# Altium schematic sheet TSAL.SchDoc
size A4; SheetNumber: 4; SheetTotal: 5
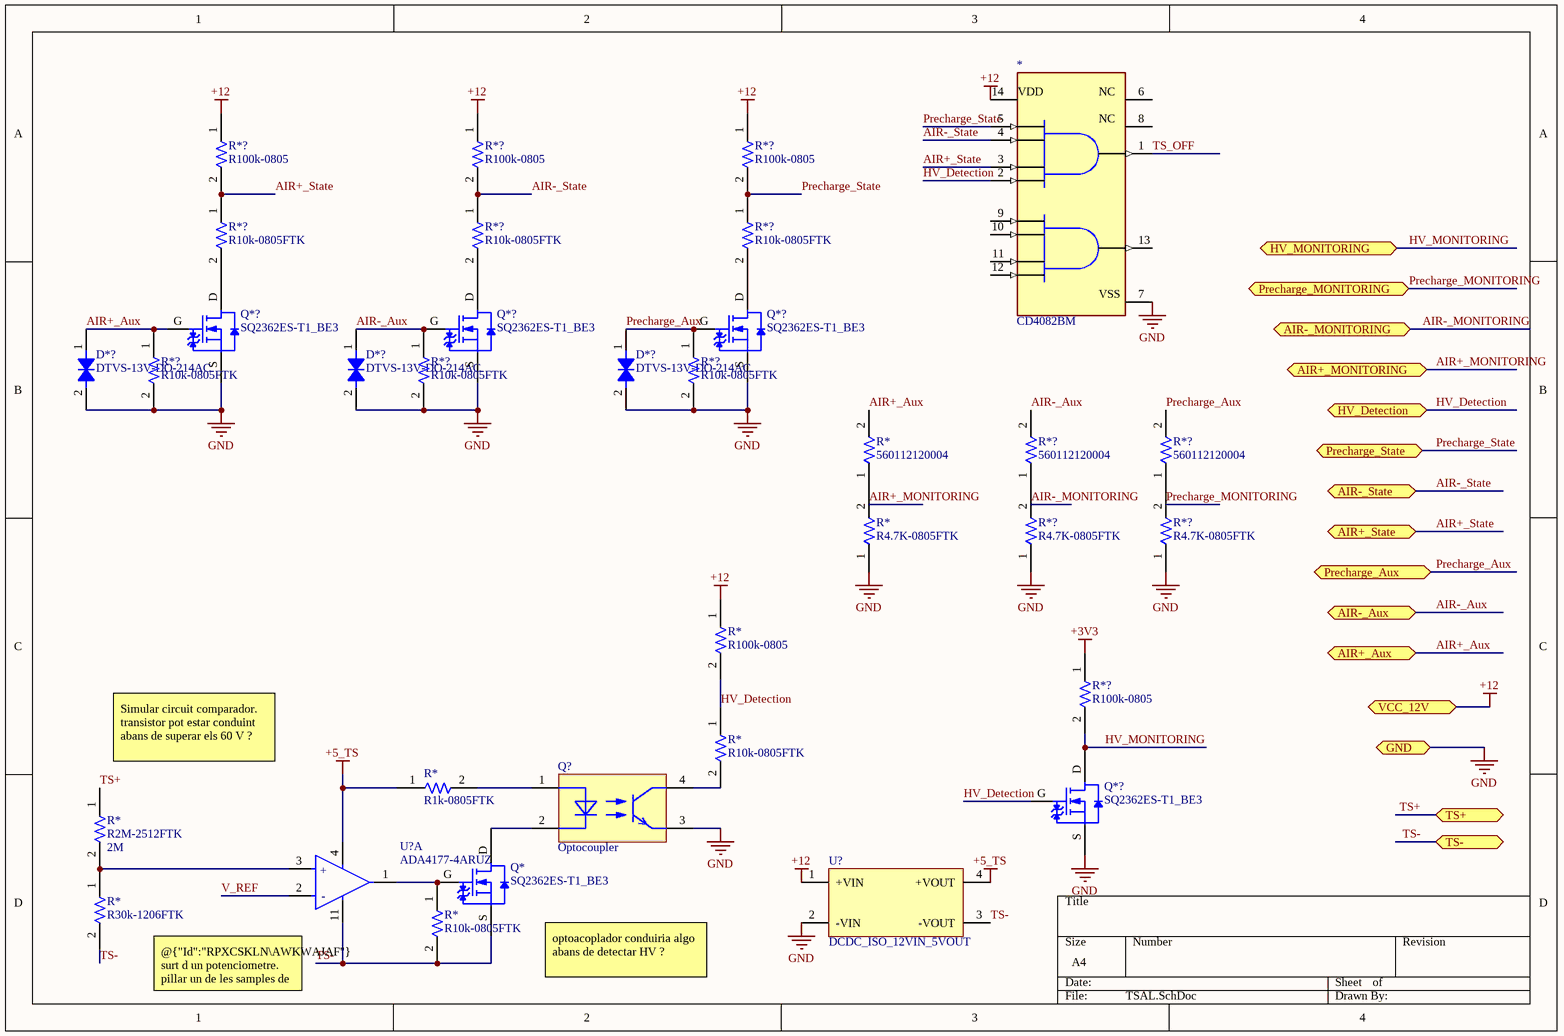
[diagram p0: TSAL.SchDoc]

## Parts
(Parts that share a designator on the sheet are numbered #1, #2 ... from top to bottom, then left to right.)
*  CD4082BM  [D0014A_M]
D*?#1  DTVS-13V-DO-214AC  [DTVS-DO-214AC]
D*?#2  DTVS-13V-DO-214AC  [DTVS-DO-214AC]
D*?#3  DTVS-13V-DO-214AC  [DTVS-DO-214AC]
Q*  SQ2362ES-T1_BE3  [SOT95P245X110-3N]
Q*?#1  SQ2362ES-T1_BE3  [SOT95P245X110-3N]
Q*?#2  SQ2362ES-T1_BE3  [SOT95P245X110-3N]
Q*?#3  SQ2362ES-T1_BE3  [SOT95P245X110-3N]
Q*?#4  SQ2362ES-T1_BE3  [SOT95P245X110-3N]
Q?  Optocoupler  [WL-OCPT_LSOP4]
R*#1  560112120004  [FP-CRCW0805-HPe3-IPC_B]
R*#2  R4.7K-0805FTK  [R0805FTK]
R*#3  R100k-0805  [RESC2013X70X40NL20T20]
R*#4  R10k-0805FTK  [R0805FTK]
R*#5  R2M-2512FTK  Resistance: 2M  [R2512FTK]
R*#6  R1k-0805FTK  [R0805FTK]
R*#7  R30k-1206FTK  [R1206FTK-W]
R*#8  R10k-0805FTK  [R0805FTK]
R*?#1  R100k-0805  [RESC2013X70X40NL20T20]
R*?#2  R100k-0805  [RESC2013X70X40NL20T20]
R*?#3  R100k-0805  [RESC2013X70X40NL20T20]
R*?#4  R10k-0805FTK  [R0805FTK]
R*?#5  R10k-0805FTK  [R0805FTK]
R*?#6  R10k-0805FTK  [R0805FTK]
R*?#7  R10k-0805FTK  [R0805FTK]
R*?#8  R10k-0805FTK  [R0805FTK]
R*?#9  R10k-0805FTK  [R0805FTK]
R*?#10  560112120004  [FP-CRCW0805-HPe3-IPC_B]
R*?#11  560112120004  [FP-CRCW0805-HPe3-IPC_B]
R*?#12  R4.7K-0805FTK  [R0805FTK]
R*?#13  R4.7K-0805FTK  [R0805FTK]
R*?#14  R100k-0805  [RESC2013X70X40NL20T20]
U?#1  ADA4177-4ARUZ  [FP-RU-14-IPC_A]  (part A of 4)
U?#2  DCDC_ISO_12VIN_5VOUT  [WPME-FISM_SIP-7_L19.65W7.05H10.16]

## Ports
AIR+_Aux (bidir, see Master_HV_PCB[1B]), AIR+_MONITORING (bidir, see Master_HV_PCB[1B]), AIR+_State (bidir, see Master_HV_PCB[1B]), AIR-_Aux (bidir, see Master_HV_PCB[1B]), AIR-_MONITORING (bidir, see Master_HV_PCB[1B]), AIR-_State (bidir, see Master_HV_PCB[1C]), GND (bidir, see Master_HV_PCB[1B]), HV_Detection (bidir, see Master_HV_PCB[1B]), HV_MONITORING (bidir, see Master_HV_PCB[1B]), Precharge_Aux (bidir, see Master_HV_PCB[1B]), Precharge_MONITORING (bidir, see Master_HV_PCB[1B]), Precharge_State (bidir, see Master_HV_PCB[1C]), TS+ (bidir, see Master_HV_PCB[1B]), TS- (bidir, see Master_HV_PCB[1B]), VCC_12V (bidir, see Master_HV_PCB[1C])

## Nets
+3V3: R*?#14.1
+5_TS: R*#6.1 U?#1.4(V+) U?#2.4(+VOUT)
+12: *.14(A) R*#3.1 R*?#1.1 R*?#2.1 R*?#3.1 U?#2.1(+VIN) ; port VCC_12V
GND: *.7(A) D*?#1.2 D*?#2.2 D*?#3.2 Q*?#1.S Q*?#2.S Q*?#3.S Q*?#4.S Q?.3(Emitter) R*#2.1 R*?#7.2 R*?#8.2 R*?#9.2 R*?#12.1 R*?#13.1 U?#2.2(-VIN) ; port GND
AIR+_Aux: D*?#1.1 Q*?#1.G R*#1.2 R*?#7.1 ; port AIR+_Aux
AIR+_MONITORING: port AIR+_MONITORING
AIR+_State: *.3(C) R*?#1.2 R*?#4.1 ; port AIR+_State
AIR-_Aux: D*?#2.1 Q*?#2.G R*?#8.1 R*?#10.2 ; port AIR-_Aux
AIR-_MONITORING: port AIR-_MONITORING
AIR-_State: *.4(B) R*?#2.2 R*?#5.1 ; port AIR-_State
HV_Detection: *.2(D) Q*?#4.G R*#3.2 R*#4.1 ; port HV_Detection
HV_MONITORING: Q*?#4.D R*?#14.2 ; port HV_MONITORING
Precharge_Aux: D*?#3.1 Q*?#3.G R*?#9.1 R*?#11.2 ; port Precharge_Aux
Precharge_MONITORING: port Precharge_MONITORING
Precharge_State: *.5(A) R*?#3.2 R*?#6.1 ; port Precharge_State
TS+: R*#5.1 ; port TS+
TS-: Q*.S R*#7.2 R*#8.2 U?#1.11(V-) U?#2.3(-VOUT) ; port TS-
TS_OFF: *.1(J)
V_REF: U?#1.2(-IN_A)
NetQ*?#1_D: Q*?#1.D R*?#4.2
NetQ*?#2_D: Q*?#2.D R*?#5.2
NetQ*?#3_D: Q*?#3.D R*?#6.2
NetQ*_D: Q*.D Q?.2(Cathode)
NetQ*_G: Q*.G R*#8.1 U?#1.1(OUT_A)
NetQ?_1: Q?.1(Anode) R*#6.2
NetQ?_4: Q?.4(Collector) R*#4.2
NetR*#1_1: R*#1.1 R*#2.2
NetR*#5_2: R*#5.2 R*#7.1 U?#1.3(+IN_A)
NetR*?#10_1: R*?#10.1 R*?#12.2
NetR*?#11_1: R*?#11.1 R*?#13.2

Not connected (* = marked no-connect by the designer): * 6(J) 8(J) 9(A) 10(B) 11(C) 12(D) 13(J)

## Notes on the sheet
- Simular circuit comparador. transistor pot estar conduint abans de superar els 60 V ?
- @{"Id":"RPXCSKLN\AWKWAJAF"} surt d un potenciometre. pillar un de les samples de vishay
- optoacoplador conduiria algo abans de detectar HV ?
- (in symbol CMP-014-00003-2, part A) +; -
- (in symbol CMP-00204-2) VDD; NC; VSS

## Library data of the parts
* = CMP-00204-2: AND Gate, 4000/14000/40000 Series, 2-Func, 4-Input, CMOS, PDSO14; Package Equivalence Code: SOP14,.25; Channels: 2; Prop. Delay@Nom-Sup: 250ns; Package Body Material: Plastic; Max Supply Voltage: 18V; Nominal Supply Voltage: 5V; Power Supplies: 5/15V; Qualification Status: Not Qualified; Load Capacitance (CL): 50pF; Number of Inputs: 4; Min Supply Voltage: 3V; Load/Preset Input: Yes; Schmitt Trigger: No; Terminal Finish: Nickel; Terminal Pitch: 1.27mm; ComponentLink7Description: https://datasheet.ciiva.com/6621/cd4011ub-6621175.pdf?src-supplier=Digi-Key; JESD-30 Code: R-PDSO-G14; Reach SVHC Compliant: Yes; Surface Mount: Yes; Temperature Grade: MILITARY; ComponentLink4Description: https://datasheet.ciiva.com/15093/getdatasheetpartid-293403-15093688.pdf?src-supplier=Verical; ComponentLink6Description: https://datasheet.ciiva.com/6621/cd4011ub-6621174.pdf?src-supplier=Digi-Key; ComponentLink3Description: https://datasheet.ciiva.com/1506/1862404-1506704.pdf?src-supplier=Element14; ComponentLink5Description: https://datasheet.ciiva.com/41455/001015562-da-01-en-ic-dual-bin-up-coun-cd4520bm-soic-16-tid-41455477.pdf?src-supplier=Conrad; ComponentLink9Description: https://datasheet.ciiva.com/6623/cd4520b-6623849.pdf?src-supplier=Digi-Key; ComponentLink10Description: Where buy it; JESD-609 Code: e4; Technology: CMOS; Moisture Sensitivity Level: 1; Pins: 14; Packaging: Rail/Tube; ComponentLink8Description: https://datasheet.ciiva.com/6621/cd4011ub-6621176.pdf?src-supplier=Digi-Key; Length: 8.65mm; Width: 3.9mm; Package Shape: Rectangular; Case/Package: SOP; Terminal Position: DUAL; Min Operating Temperature: -55°C; Peak Reflow Temperature (Cel): 260°C; Logic Type: AND GATE; ComponentLink1Description: https://datasheet.ciiva.com/14295/cd4520b-mil-14295930.pdf?src-supplier=Avnet; Max Operating Temperature: 125°C; Propagation Delay (tpd): 250ns; ComponentLink2Description: https://datasheet.ciiva.com/14307/cd4011ub-mil-14307943.pdf?src-supplier=Avnet; RoHS Compliant: Yes; Height - Seated (Max): 1.75mm; Terminal Form: Gull Wing; Package Style: SMALL OUTLINEMeter
D*?#1-D*?#3 = CMP-00155-1: Tvs Diode, 400W, 13V, Bidir, DO-214AC; Manufacturer Part Number: 824501131; Manufacturer: Wurth Electronics; Peak Pulse Current: 18.6A; Power Line Protection: No; .Creator: DO; Forward Voltage: 15.15V; Polarity: Bidirectional; Number of Bidirectional Channels: 1; Clamping Voltage: 21.5V; Max Operating Temperature: 150°C; Category: TVS Diodes; Stock 1: 1000; RoHS: Yes; ComponentLink3Description: Where buy it; Source: Filter components.SchLib; Design Item ID: DTVS-13V-DO-214AC; REACH SVHC: Unknown; Min Operating Temperature: -65°C; Resistor Type: Zener; ComponentLink2Description: http://www.farnell.com/datasheets/2036399.pdf?src-supplier=Element14; Peak Pulse Power: 400W; ComponentLink1URL: https://katalog.we-online.de/pbs/datasheet/824501131.pdf?src-supplier=Digi-Key; Packaging: Cut Tape; ComponentLink2URL: http://www.farnell.com/datasheets/2036399.pdf?src-supplier=Element14; ComponentLink3URL: https://www.we-online.com/catalog/en/WE-TVSP?sq=824501131#824501131; RoHS Compliant: Yes; Reverse Standoff Voltage: 13V; Mount: Surface Mount; Min Breakdown Voltage: 15.15V; ComponentLink1Description: https://katalog.we-online.de/pbs/datasheet/824501131.pdf?src-supplier=Digi-Key; Pricing 1: 1=0,27000 (USD); Pins: 2
Q* Q*?#1-Q*?#4 = CMP-013-00001-1: Small Signal Field-Effect Transistor; RoHS Compliant: Yes
Q? = CMP-00195-1: Transistor Output Optocoupler. S/N: 140100146000; RoHS Compliant: Yes
R*#1 R*?#10 R*?#11 = CMP-009-00021-1: Resistor, 10K, 0.25W, Thick Film, 0805 Rohs Compliant: Yes
R*#2 R*?#12 R*?#13 = CMP-00102-1: Res Thick Film 0805 4.7K Ohm 5% 1/8W ±200ppm/°C Molded SMD SMD Paper Tape on Plastic Reel; Manufacturer Part Number 1: CR0805-JW-472ELF; Manufacturer 1: Bourns; Max Power Dissipation: 125mW; .Creator: DR; Voltage Rating (DC): 150V; ComponentLink5URL: https://datasheet.ciiva.com/9122/chpreztr-9122814.pdf?src-supplier=Avnet; ComponentLink2URL: https://datasheet.ciiva.com/6560/chpreztr-6560073.pdf?src-supplier=Digi-Key; Depth: 1.25mm; ComponentLink7URL: https://datasheet.ciiva.com/6560/chpreztr-6560075.pdf?src-supplier=Digi-Key; Radiation Hardening: No; ComponentLink5Description: https://datasheet.ciiva.com/9122/chpreztr-9122814.pdf?src-supplier=Avnet; Construction: Rectangular; Case/Package: 0805; Design Item ID: R4.7K-0805FTK; RoHS Compliant: Yes; Min Operating Temperature: -55°C; Height: 0.024inch; ComponentLink1Description: https://datasheet.ciiva.com/5541/chpreztr-5541593.pdf?src-supplier=Mouser; Series: CR0805; Packaging: Tape and Reel; Width: 0.049inch; Stock 1: 3734; ComponentLink3URL: https://datasheet.ciiva.com/6560/chpreztr-6560074.pdf?src-supplier=Digi-Key; ComponentLink4URL: https://datasheet.ciiva.com/30174/159chpreztr-30174252.pdf?src-supplier=Onlinecomponents.com; Value: 4.7k; Military Standard: Not; Tolerance: 5%; Voltage Rating: 150V; ComponentLink6Description: https://datasheet.ciiva.com/22713/691949-22713272.pdf?src-supplier=Element14; REACH SVHC: No SVHC; Package Quantity: 1; Termination: SMD/SMT; ComponentLink1URL: https://datasheet.ciiva.com/5541/chpreztr-5541593.pdf?src-supplier=Mouser; ComponentLink4Description: https://datasheet.ciiva.com/30174/159chpreztr-30174252.pdf?src-supplier=Onlinecomponents.com; Resistor Type: Thick Film; Length: 2mm; Case Code (Metric): 2012; Category: Chip SMD Resistors; Resistance Tolerance: 5%; Thickness: 508um; ComponentLink6URL: https://datasheet.ciiva.com/22713/691949-22713272.pdf?src-supplier=Element14; Features: Moisture Resistant; Power Rating: 125mW; RoHS: Yes; Mount: Surface Mount; ComponentLink7Description: https://datasheet.ciiva.com/6560/chpreztr-6560075.pdf?src-supplier=Digi-Key; Number of Terminations: 2; Source: Passives.SchLib; Temperature Coefficient: 200ppm/°C; Max Operating Temperature: 155°C; ComponentLink3Description: https://datasheet.ciiva.com/6560/chpreztr-6560074.pdf?src-supplier=Digi-Key; ComponentLink2Description: https://datasheet.ciiva.com/6560/chpreztr-6560073.pdf?src-supplier=Digi-Key; Pricing 1: 1=0,05590, 10=0,01670, 25=0,01290, 100=0,00840, 250=0,00830, 500=0,00690, 1000=0,00410 (USD); Contact Plating: Tin
R*#3 R*?#1-R*?#3 R*?#14 = CMP-009-00003-2: Fixed Resistor, Metal Glaze/thick Film, 0.125W, 100000ohm, 150V, 5% +/-Tol, 200ppm/Cel, Surface Mount, 0805; Value: 100k; Power: 125mW; Max Operating Temperature: 155°C; Mounting Technology: Surface Mount; RoHS Compliant: Yes; Min Operating Temperature: -55°C; Pins: 2; Case/Package: 0805; Tolerance: 5%
R*#4 R*#8 R*?#4-R*?#9 = CMP-00085-1: BOURNS         CR0805-JW-103ELF            Surface Mount Chip Resistor, Thick Film, CR Series, 10 kohm, 125 mW,  5%, 150 V; .Creator: DR; Power Rating: 125mW; Voltage Rating (DC): 100V; Voltage Rating: 150V; Temperature Coefficient: 200ppm/°C; Value: 10k; ComponentLink6URL: https://datasheet.ciiva.com/16783/70154685-16783482.pdf?src-supplier=Allied+Electronics; Manufacturer 1: Bourns; Package Quantity: 1; ComponentLink10URL: https://datasheet.ciiva.com/7985/1856384-7985869.pdf?src-supplier=Element14; Technology: THICK FILM; Source: Passives.SchLib; RoHS Compliant: Yes; ComponentLink10Description: https://datasheet.ciiva.com/7985/1856384-7985869.pdf?src-supplier=Element14; ComponentLink1URL: https://datasheet.ciiva.com/11821/0900766b80fcdb72-11821135.pdf?src-supplier=RSComponents; ComponentLink7Description: https://datasheet.ciiva.com/5548/chpreztr-5548491.pdf?src-supplier=Mouser; Radiation Hardening: No; Design Item ID: R10k-0805FTK; ComponentLink4Description: https://datasheet.ciiva.com/7986/691949-7986187.pdf?src-supplier=Element14; Pins: 2; ComponentLink9URL: https://datasheet.ciiva.com/6559/chpreztr-6559901.pdf?src-supplier=Digi-Key; Resistor Type: Thick Film; ComponentLink4URL: https://datasheet.ciiva.com/7986/691949-7986187.pdf?src-supplier=Element14; Contact Plating: Tin; Case Code (Metric): 2012; Military Standard: Not; Depth: 1.25mm; Case/Package: 0805; Packaging: Tape and Reel; ComponentLink9Description: https://datasheet.ciiva.com/6559/chpreztr-6559901.pdf?src-supplier=Digi-Key; Construction: Rectangular; Pricing 1: 1=0,05790, 10=0,01540, 25=0,01340, 100=0,00340 (USD); ComponentLink7URL: https://datasheet.ciiva.com/5548/chpreztr-5548491.pdf?src-supplier=Mouser; Category: Chip SMD Resistors; Length: 2mm; Max Operating Temperature: 155°C; Resistance Tolerance: 5%; Manufacturer Part Number 1: CR0805-JW-103ELF; Height: 0.5mm; ComponentLink2URL: https://datasheet.ciiva.com/9122/chpreztr-9122374.pdf?src-supplier=Avnet; Thickness: 508um; Max Power Dissipation: 125mW; ComponentLink8Description: https://datasheet.ciiva.com/6559/chpreztr-6559900.pdf?src-supplier=Digi-Key; REACH SVHC: No SVHC; ComponentLink8URL: https://datasheet.ciiva.com/6559/chpreztr-6559900.pdf?src-supplier=Digi-Key; ComponentLink5URL: https://datasheet.ciiva.com/30065/159chpreztr-30065976.pdf?src-supplier=Onlinecomponents.com; Width: 1.25mm; ComponentLink11URL: https://datasheet.ciiva.com/48692/001055517-da-01-en-smd-wid-cr0805-jw-103elf-10k-ohm-1-8w-48692118.pdf?src-supplier=Conrad; ComponentLink3Description: https://datasheet.ciiva.com/22693/1902866-22693254.pdf?src-supplier=Element14; ComponentLink11Description: https://datasheet.ciiva.com/48692/001055517-da-01-en-smd-wid-cr0805-jw-103elf-10k-ohm-1-8w-48692118.pdf?src-supplier=Conrad; ComponentLink1Description: https://datasheet.ciiva.com/11821/0900766b80fcdb72-11821135.pdf?src-supplier=RSComponents; ComponentLink2Description: https://datasheet.ciiva.com/9122/chpreztr-9122374.pdf?src-supplier=Avnet; Stock 1: 57566; Min Operating Temperature: -55°C; Series: CR0805; Number of Terminations: 2; Termination: SMD/SMT; Tolerance: 5%; Mount: Surface Mount; ComponentLink6Description: https://datasheet.ciiva.com/16783/70154685-16783482.pdf?src-supplier=Allied+Electronics; ComponentLink5Description: https://datasheet.ciiva.com/30065/159chpreztr-30065976.pdf?src-supplier=Onlinecomponents.com; RoHS: Yes; Features: Moisture Resistant; ComponentLink3URL: https://datasheet.ciiva.com/22693/1902866-22693254.pdf?src-supplier=Element14
R*#5 = CMP-00108-1: Current Sense Resistors - SMD 3watts .002ohms 1%; Manufacturer: Vishay Dale; Manufacturer Part Number: WSLP25122L000FEA; Power Rating: 3W; Temperature Coefficient: 275ppm/°C; Packaging: Tape and Reel; Height: 0.635mm; Weight: 0.001429oz; Case Code (Imperial): 2512; Source: Passives.SchLib; Tolerance: 1%; Termination: SMD/SMT; RoHS: Yes; Size Code: 2512; Case Code (Metric): 6432; Stock 1: 11994; ComponentLink1URL: https://datasheet.ciiva.com/48527/wslp-48527354.pdf?src-supplier=Avnet; Package Quantity: 2000; Length: 6.4mm; Resistor Type: Metal Strip; ComponentLink1Description: https://datasheet.ciiva.com/48527/wslp-48527354.pdf?src-supplier=Avnet; Design Item ID: R2M-2512FTK; Mount: Surface Mount; Width: 3.2mm; Category: Chip SMD Resistors; RoHS Compliant: Yes; Case/Package: 2512; Max Operating Temperature: 170°C; Lead Free: Lead Free; Pricing 1: 1=1,07000, 10=1,07000, 50=1,07000, 100=1,07000, 1000=0,77100, 10000=0,75500 (USD); Series: WSLP; Min Operating Temperature: -65°C
R*#6 = CMP-00076-1: Res Thick Film 0805 1K Ohm 5% 1/8W ±200ppm/°C Molded SMD SMD Paper Tape on Plastic Reel; Manufacturer Part Number 1: CR0805-JW-102ELF; Manufacturer 1: Bourns; Voltage Rating (DC): 150V; Power Rating: 125mW; .Creator: GP; Number of Terminations: 2; REACH SVHC: No SVHC; ComponentLink3URL: https://datasheet.ciiva.com/22693/1902866-22693253.pdf?src-supplier=Element14; ComponentLink1URL: https://datasheet.ciiva.com/11821/0900766b80fcdb72-11821134.pdf?src-supplier=RSComponents; ComponentLink1Description: https://datasheet.ciiva.com/11821/0900766b80fcdb72-11821134.pdf?src-supplier=RSComponents; Category: Chip SMD Resistors; Stock 1: 27510; Case/Package: 0805; ComponentLink3Description: https://datasheet.ciiva.com/22693/1902866-22693253.pdf?src-supplier=Element14; Length: 2mm; ComponentLink5URL: https://datasheet.ciiva.com/7985/1856384-7985867.pdf?src-supplier=Element14; ComponentLink7Description: https://datasheet.ciiva.com/6547/chpreztr-6547359.pdf?src-supplier=Digi-Key; Package Quantity: 1; Tolerance: 5%; Lead Free: Lead Free; RoHS: Yes; Contact Plating: Tin; ComponentLink2Description: https://datasheet.ciiva.com/15225/getdatasheetpartid-78155-15225381.pdf?src-supplier=Verical; ComponentLink5Description: https://datasheet.ciiva.com/7985/1856384-7985867.pdf?src-supplier=Element14; Depth: 1.25mm; Thickness: 508um; Resistor Type: Thick Film; Design Item ID: R1k-0805FTK; ComponentLink2URL: https://datasheet.ciiva.com/15225/getdatasheetpartid-78155-15225381.pdf?src-supplier=Verical; Max Operating Temperature: 155°C; ComponentLink6URL: https://datasheet.ciiva.com/30242/159chpreztr-30242765.pdf?src-supplier=Onlinecomponents.com; ComponentLink4URL: https://datasheet.ciiva.com/7986/1856384-7986184.pdf?src-supplier=Element14; Military Standard: Not; Case Code (Metric): 2012; Temperature Coefficient: 200ppm/°C; Pricing 1: 1=0,05930, 10=0,03510, 25=0,01790, 100=0,00800, 250=0,00790, 500=0,00590, 1000=0,00360, 3000=0,00350, 6000=0,00250 (USD); Min Operating Temperature: -55°C; ComponentLink7URL: https://datasheet.ciiva.com/6547/chpreztr-6547359.pdf?src-supplier=Digi-Key; Width: 1.25mm; Source: Passives.SchLib; Max Power Dissipation: 125mW; Voltage Rating: 150V; ComponentLink4Description: https://datasheet.ciiva.com/7986/1856384-7986184.pdf?src-supplier=Element14; Features: Moisture Resistant; Mount: Surface Mount; Termination: SMD/SMT; Value: 1k; Height: 0.5mm; Radiation Hardening: No; ComponentLink6Description: https://datasheet.ciiva.com/30242/159chpreztr-30242765.pdf?src-supplier=Onlinecomponents.com; Pins: 2; Packaging: Tape and Reel
R*#7 = CMP-00092-1: Res Thick Film 1206 30K Ohm 1% 1/4W ±100ppm/°C Molded SMD SMD Paper T/R; Manufacturer: Vishay; Manufacturer Part Number: CRCW120630K0FKEA; Max Power Dissipation: 250mW; Voltage Rating: 200V; .Creator: GP; Military Standard: Not; Min Operating Temperature: -55°C; Tolerance: 1%; Category: Resistor; Pins: 2; Resistor Type: Thick Film; Height: 0.55mm; Resistance Tolerance: 1%; ComponentLink2URL: https://es.rs-online.com/web/p/resistencias-de-montaje-en-superficie/6792039; Series: CRCW; ComponentLink1URL: https://docs.rs-online.com/bca8/A700000006404581.pdf; Termination: SMD/SMT; Radiation Hardening: No; Case/Package: 1206; Max Operating Temperature: 155°C; Case Code (Metric): 3216; RoHS: Yes; Power Rating: 250mW; Pricing 1: 50=0,12000, 500=0,11200, 1000=0,10400, 2000=0,09700, 4000=0,08900 (USD); Stock 1: 3550; ComponentLink2Description: Where buy it; Construction: Rectangular; Packaging: Tape and Reel; ComponentLink1Description: Datasheet; RoHS Compliant: Yes; Temperature Coefficient: 100ppm/°C; Size Code: 1206; Package Quantity: 10; Number of Terminations: 2; Value: 30k; REACH SVHC: Unknown; Technology: THICK FILM; Length: 3.2mm; Contact Plating: Tin; Depth: 1.6mm; Features: Automotive AEC-Q200; Source: Passives.SchLib; Design Item ID: R30k-1206FTK; Width: 1.6mm; Weight: 0.000353oz
U?#1 = CMP-014-00003-2: Operational Amplifier, 4 Func, 300uV Offset-Max, BIPolar, PDSO14; Nominal Supply Voltage: 5V; Channels: 4; RoHS Compliant: Yes; Min Operating Temperature: -40°C; Max Operating Temperature: 125°C; Pins: 14; Case/Package: TSSOP
U?#2 = CMP-019-00001-1: WPME-FISM Fixed Isolated SIP/SMT Module